# Altium schematic sheet DSV1-001（主板）原理图 V2.SchDoc: DSV1-001（主板）原理图
size A4; Date: a; ApprovedBy: 戚大周; CheckedBy: 戚大周; Author: 戚大周; CompanyName: i; DrawnBy: g; Engineer: h; Organization: 湖北滴水科技有限公司; Address1: 20230202; Address2: 20230202; Address3: 20230202; Address4: r; DocumentNumber: f; Revision: V2; SheetNumber: 1; SheetTotal: 1; PageSetup: Record=PageOptions|CenterHorizontal=True|CenterVertical=True|PrintScale=1.00|XCorrection=1.00|YCorrection=1.00|PrintKind=1|BorderSize=5000000|LeftOffset=0|BottomOffset=0|Orientation=2|PaperLength=1000|PaperWidth=1000|Scale=100|PaperSource=15|PrintQuality=1200|MediaType=1|DitherType=10|PaperKind=A4|PrintScaleMode=1; CurrentTime: p; CurrentDate: o; Time: v; DocumentFullPathAndName: s; DocumentName: d; ModifiedDate: k; ImagePath: j; ProjectName: l
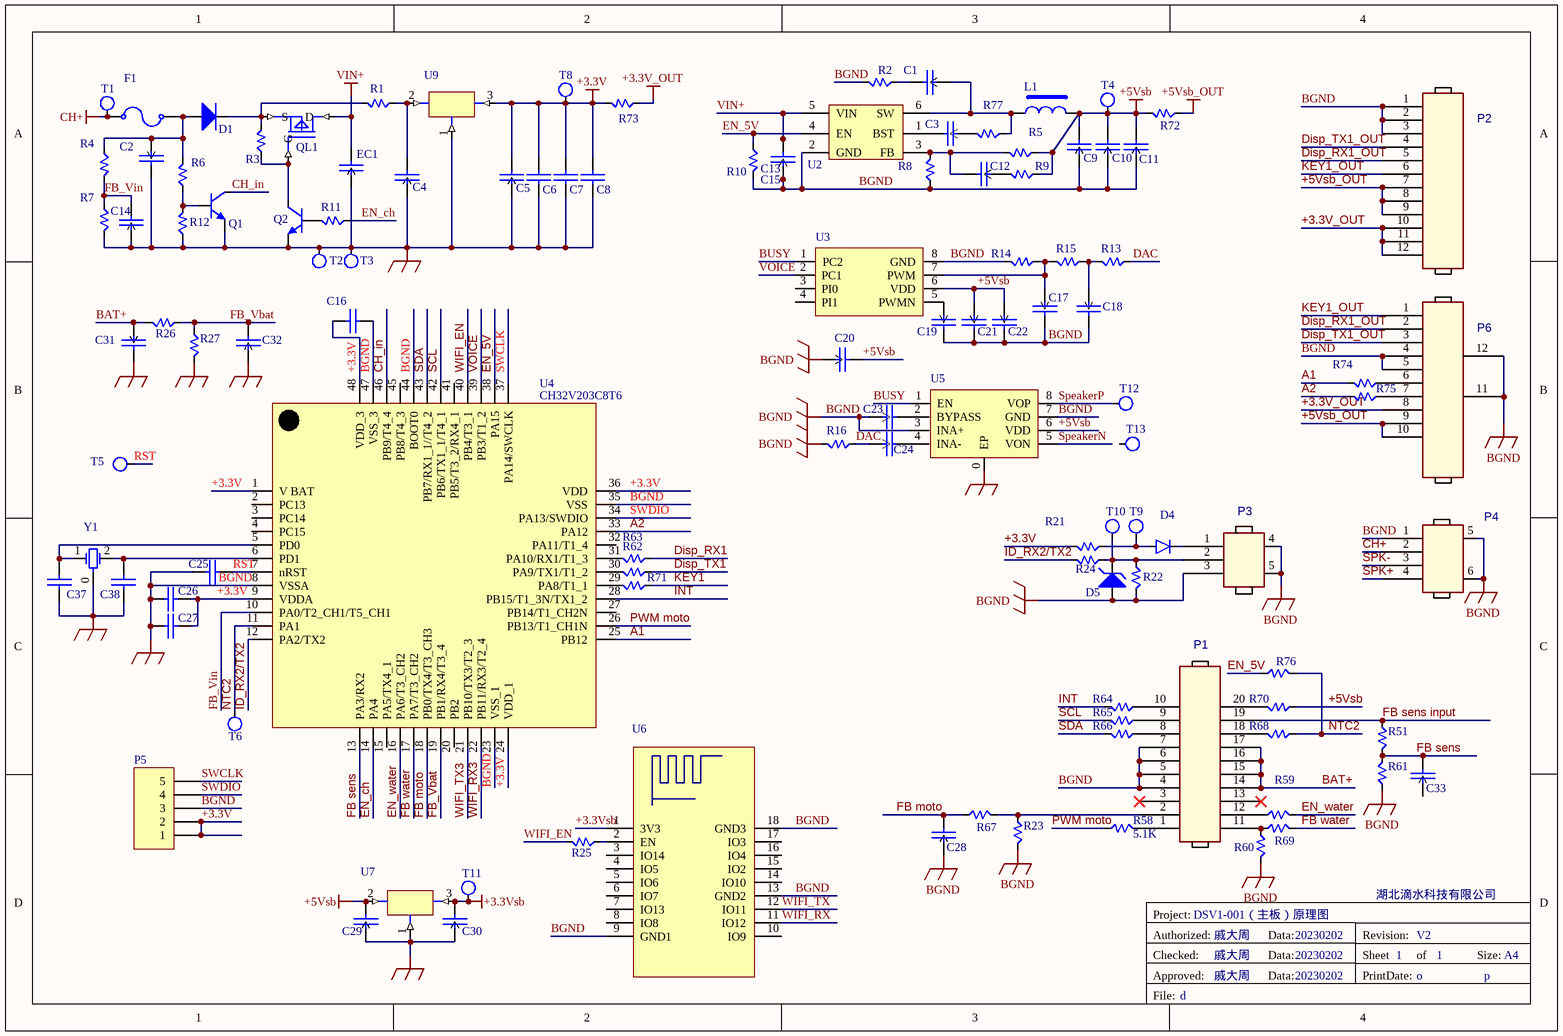
[diagram p0: DSV1-001（主板）原理图 V2.SchDoc]

## Parts
C1  102  [0603C]  (value not drawn)
C2  104  [0603C]  (value not drawn)
C3  104  [0603C]  (value not drawn)
C4  104  [0603C]  (value not drawn)
C5  226  [0603C]  (value not drawn)
C6  226  [0603c]  (value not drawn)
C7  103  [0603c]  (value not drawn)
C8  104  [0603c]  (value not drawn)
C9  226  [0603C]  (value not drawn)
C10  226  [0603C]  (value not drawn)
C11  104  [0603C]  (value not drawn)
C12  101  [0603C]  (value not drawn)
C13  104  [0603C]  (value not drawn)
C14  104  [0603C]  (value not drawn)
C15  104  [0603C]  (value not drawn)
C16  103  [0603c]  (value not drawn)
C17  102  [0603C]  (value not drawn)
C18  102  [0603C]  (value not drawn)
C19  102  [0603C]  (value not drawn)
C20  104  [0603C]  (value not drawn)
C21  105  [0805C]  (value not drawn)
C22  226  [0805C]  (value not drawn)
C23  105  [0603C]  (value not drawn)
C24  104  [0603C]  (value not drawn)
C25  103  [0603c]  (value not drawn)
C26  104  [0603c]  (value not drawn)
C27  105  [0603c]  (value not drawn)
C28  104  [0603C]  (value not drawn)
C29  NC  [0603c]  (value not drawn)
C30  NC  [0603c]  (value not drawn)
C31  104  [0603C]  (value not drawn)
C32  104  [0603C]  (value not drawn)
C33  104  [0603C]  (value not drawn)
C37  12P  [0603c]  (value not drawn)
C38  12P  [0603c]  (value not drawn)
D1  SS54L  [SMB-A]  (value not drawn)
D4  LMBR340  [SOD-123]  (value not drawn)
D5  TVS3.3V  [SOD-123]  (value not drawn)
EC1  476  [1210-c]  (value not drawn)
F1  1200mA/24V  [1206-R]  (value not drawn)
L1  4R7  [CLD-54]  (value not drawn)
P1  SGDBM-08-020P-H70  [SGDBM_08_020P_H40]  (value not drawn)
P2  SGDBM-08-012P-H70  [SGDBM_08_012P_H40]  (value not drawn)
P3  HEADER 3  [con125_03_wt_thw]  (value not drawn)
P4  BC-60-4P300-C06  [BC_60_4P_C06]  (value not drawn)
P5  (no value)  [2.0-5 顶针焊盘]
P6  HC 0.8 10PWT  [HC_08_10PWT]  (value not drawn)
Q1  MMBT2222A  [SOT-23-ss]  (value not drawn)
Q2  MMBT2222A  [SOT-23-ss]  (value not drawn)
QL1  MOS-P  [SOT-23-MOS-N]  (value not drawn)
R1  100R/0805  [0603R]  (value not drawn)
R2  22R  [0603R]  (value not drawn)
R3  510K  [0603r]  (value not drawn)
R4  10K  [0805R]  (value not drawn)
R5  68K  [0603R]  (value not drawn)
R6  100K  [0603R]  (value not drawn)
R7  1.6K  [0805r]  (value not drawn)
R8  9.1K  [0603R]  (value not drawn)
R9  2K  [0603R]  (value not drawn)
R10  100K  [0603R]  (value not drawn)
R11  5.1K  [0603R]  (value not drawn)
R12  10K  [0603R]  (value not drawn)
R13  10K  [0603R]  (value not drawn)
R14  470R  [0603R]  (value not drawn)
R15  4.7K  [0603R]  (value not drawn)
R16  2K  [0603R]  (value not drawn)
R21  16V/50mA  [0603r]  (value not drawn)
R22  1M  [0603R]  (value not drawn)
R23  10K  [0603R]  (value not drawn)
R24  1K  [0603r]  (value not drawn)
R25  NC  [0603r]  (value not drawn)
R26  10M  [0603r]  (value not drawn)
R27  1.6M  [0603r]  (value not drawn)
R51  5.1K  [0603R]  (value not drawn)
R58  5.1K  [0603R]
R59  5.1K  [0603R]  (value not drawn)
R60  10K  [0603R]  (value not drawn)
R61  10K  [0603R]  (value not drawn)
R62  100R  [0603R]  (value not drawn)
R63  100R  [0603R]  (value not drawn)
R64  100R  [0603R]  (value not drawn)
R65  100R  [0603R]  (value not drawn)
R66  100R  [0603R]  (value not drawn)
R67  1K  [0603R]  (value not drawn)
R68  100R  [0603R]  (value not drawn)
R69  1K  [0603R]  (value not drawn)
R70  33R  [0603R]  (value not drawn)
R71  1K  [0603R]  (value not drawn)
R72  0R  [0603R]  (value not drawn)
R73  33R  [0603R]  (value not drawn)
R74  100R  [0603R]  (value not drawn)
R75  100R  [0603R]  (value not drawn)
R76  10K  [0603R]  (value not drawn)
R77  0R  [0603R]  (value not drawn)
T1  (no value)  [TP]
T2  (no value)  [TP]
T3  (no value)  [TP]
T4  (no value)  [TP]
T5  (no value)  [TP]
T6  (no value)  [TP]
T8  (no value)  [TP]
T9  (no value)  [TP]
T10  (no value)  [TP]
T11  (no value)  [TP]
T12  (no value)  [TP]
T13  (no value)  [TP]
U2  JW5057S  [SOT23-6-T]  (value not drawn)
U3  FT61F141-RB  [SOP-8 xiao]  (value not drawn)
U4  CH32V203C8T6  [LQFP-48]
U5  FT61F141-RB  [SOP-8-0]  (value not drawn)
U6  HI3861  [ESP8266]  (value not drawn)
U7  LD1117AGC33  [SOT-89]  (value not drawn)
U9  ME6239A33M3G  [SOT-89]  (value not drawn)
Y1  8M  [3225 XTAL]  (value not drawn)

## Nets
+3.3V: C5.2 C6.1 C7.1 C8.1 C16.2 C26.1 C27.1 P5.1 P5.2 R21.2 R73.2 T8.1 U4.1(V_BAT) U4.9(VDDA) U4.24(VDD_1) U4.36(VDD) U4.48(VDD_3) U9.3
+3.3V_OUT: P2.10 P2.11 P2.12 P6.8 R73.1
+3.3Vsb: C30.2 T11.1 U6.1(3V3) U7.3
+5Vsb: C9.2 C10.2 C11.2 C20.2 C21.1 C22.1 C29.2 L1.2 R5.1 R9.1 R70.2 R72.2 T4.1 U3.6(VDD) U5.6(VDD) U7.2
+5Vsb_OUT: P2.7 P2.8 P2.9 P6.9 P6.10 R72.1
BGND: C2.2 C4.1 C5.1 C6.2 C7.2 C8.2 C9.1 C10.1 C11.1 C13.1 C14.1 C15.1 C16.1 C17.2 C18.2 C19.2 C20.1 C21.2 C22.2 C23.1 C25.2 C26.2 C27.2 C28.1 C29.1 C30.1 C31.2 C32.1 C37.2 C38.2 D5.1(A) EC1.1 P1.4 P1.5 P1.6 P1.7 P2.1 P2.2 P2.3 P3.3 P3.4 P3.5 P4.1 P4.5 P4.6 P5.3 P6.4 P6.5 P6.11 P6.12 Q1.2 Q2.2 R2.2 R7.1 R8.1 R10.2 R12.1 R14.1 R16.1 R22.1 R23.1 R27.1 R60.1 R61.2 T2.1 T3.1 U2.2(GND) U3.8(GND) U4.8(VSSA) U4.23(VSS_1) U4.35(VSS) U4.44(BOOT0) U4.47(VSS_3) U5.0(EP) U5.3(INA+) U5.7(GND) U6.9(GND1) U6.13(GND2) U6.18(GND3) U7.1 U9.1 Y1.0(GND)
CH+: F1.1 P4.2 T1.1
VIN+: C13.2 C15.2 EC1.2 QL1.D U2.5(VIN)
A1: R74.2 U4.25(PB12)
A2: R75.2 U4.33(PA12)
BAT+: C31.1 P1.14 P1.15 P1.16 P1.17 R26.1
BUSY: U3.1(PC2) U5.1(EN)
CH_in: Q1.3 U4.46(PB9/T4_4)
DAC: C24.1 R13.2 R16.2
Disp_RX1: R63.2
Disp_RX1_OUT: P2.5 P6.2
Disp_TX1: R62.2
Disp_TX1_OUT: P2.4 P6.3
EN_5V: R10.1 R76.2 U2.4(EN) U4.38(PA15)
EN_ch: R11.1 U4.14(PA4)
EN_water: R59.1 U4.16(PA6/T3_CH2)
FB moto: C28.2 R67.2 U4.18(PB0/TX4/T3_CH3)
FB sens: C33.2 R51.1 R61.1 U4.13(PA3/RX2)
FB sens input: P1.19 R51.2
FB water: R69.1 U4.17(PA7/T3_CH2)
FB_Vbat: C32.2 R26.2 R27.2 U4.19(PB1/RX4/T3_4)
FB_Vin: C14.2 R4.2 R7.2 U4.10(PA0/T2_CH1/T5_CH1)
ID_RX2/TX2: R24.2 U4.12(PA2/TX2)
INT: R64.1 U4.28(PB15/T1_3N/TX1_2)
KEY1: R71.2
KEY1_OUT: P2.6 P6.1
NTC2: R68.2 R76.1 T6.1 U4.11(PA1)
PWM moto: R58.2 U4.26(PB13/T1_CH1N)
RST: C25.1 T5.1 U4.7(nRST)
SCL: R65.1 U4.42(PB6/TX1_1/T4_1)
SDA: R66.1 U4.43(PB7/RX1_1//T4_2)
SpeakerN: U5.5(VON)
SpeakerP: T12.1 U5.8(VOP)
SPK+: P4.4
SPK-: P4.3
SWCLK: P5.5 U4.37(PA14/SWCLK)
SWDIO: P5.4 U4.34(PA13/SWDIO)
VOICE: U3.2(PC1) U4.39(PB3/T1_2)
WIFI_EN: R25.2 U4.40(PB4/T3_1)
WIFI_RX: U6.11(IO12)
WIFI_RX3: U4.22(PB11/RX3/T2_4)
WIFI_TX: U6.12(IO11)
WIFI_TX3: U4.21(PB10/TX3/T2_3)
NetC1_1: C1.1 L1.1 R77.1 U2.6(SW)
NetC1_2: C1.2 R2.1
NetC2_1: C2.1 D1.1(A) F1.2 R4.1 R6.2
NetC3_1: C3.1 R77.2
NetC3_2: C3.2 U2.1(BST)
NetC4_2: C4.2 R1.1 U9.2
NetC12_1: C12.1 R9.2
NetC12_2: C12.2 R5.2 R8.2 U2.3(FB)
NetC17_1: C17.1 R14.2 R15.1 U3.7(PWM)
NetC18_1: C18.1 R13.1 R15.2
NetC19_1: C19.1 U3.5(PWMN)
NetC23_2: C23.2 U5.2(BYPASS)
NetC24_2: C24.2 U5.4(INA-)
NetC37_1: C37.1 U4.5(PD0) Y1.1(OSC1)
NetC38_1: C38.1 U4.6(PD1) Y1.2(OSC2)
NetD1_2: D1.2(K) QL1.S R1.2 R3.2
NetD4_1: D4.1 R21.1 T9.1
NetD4_2: D4.2 P3.1
NetD5_2: D5.2(K) P3.2 R22.2 R24.1 T10.1
NetP1_1: P1.1 R58.1
NetP1_2: P1.2 R23.2 R67.1
NetP1_8: P1.8 R66.2
NetP1_9: P1.9 R65.2
NetP1_10: P1.10 R64.2
NetP1_11: P1.11 R60.2 R69.2
NetP1_12: P1.12 R59.2
NetP1_18: P1.18 R68.1
NetP1_20: P1.20 R70.1
NetP6_6: P6.6 R74.1
NetP6_7: P6.7 R75.1
NetQ1_1: Q1.1 R6.1 R12.2
NetQ2_1: Q2.1 R11.2
NetQ2_3: Q2.3 QL1.G R3.1
NetR25_1: R25.1 U6.2(EN)
NetR62_1: R62.1 U4.30(PA9/TX1/T1_2)
NetR63_1: R63.1 U4.31(PA10/RX1/T1_3)
NetR71_1: R71.1 U4.29(PA8/T1_1)

Not connected (* = marked no-connect by the designer): C33 1; P1 3* 13*; T13 1; U3 3(PI0) 4(PI1); U4 2(PC13) 3(PC14) 4(PC15) 15(PA5/TX4_1) 20(PB2) 27(PB14/T1_CH2N) 32(PA11/T1_4) 41(PB5/T3_2/RX4_1) 45(PB8/T4_3); U6 3(IO14) 4(IO5) 5(IO6) 6(IO7) 7(IO13) 8(IO8) 10(IO9) 14(IO10) 15(IO2) 16(IO4) 17(IO3)

## Notes on the sheet
- Project:
- Authorized:
- Checked:
- Approved:
- Data:
- Revision:
- Sheet
- PrintDate:
- of
- Size:
- A4
- File:

## Library data of the parts
C1 C17-C19 = CAP: Capacitor; 规格: 102/50V  0603  X7R  ±10%; 名称: 贴片电容
C2-C4 C11 C13-C15 C20 C24 C28 C31-C33 = CAP: Capacitor; 规格: 104/50V  0603  X7R  ±10%; 名称: 贴片电容
C5 C9 C10 C22 = CAP: Capacitor; 规格: 226/6.3V 0805  X7R  ±10%; 名称: 贴片电容
C6 = CAP: 规格: 226/6.3V 0805  X7R  ±10%; 名称: 贴片电容
C7 C16 C25 = CAP: 规格: 103/50V  0603  X7R  ±10%; 名称: 贴片电容
C8 C26 = CAP: 规格: 104/50V  0603  X7R  ±10%; 名称: 贴片电容
C12 = CAP: Capacitor; 规格: 101/50V  0603  X7R  ±10%; 名称: 贴片电容
C21 = CAP: Capacitor; 规格: 105/16V  0603  X7R  ±10%; 名称: 贴片电容
C23 = CAP: Capacitor; 规格: 105/50V  0603  X7R  ±10%; 名称: 贴片电容
C27 = CAP: 规格: 105/16V  0603  X7R  ±10%; 名称: 贴片电容
C29 C30 = CAP: Capacitor; 名称: 贴片电容; 规格: NC
C37 C38 = CAP: 规格: 12P/50V  0603  NPO  ±10%; 名称: 贴片电容
D1 = Diode 1N4448: High Conductance Fast Diode; 规格: SS54L/SMB/5A肖特基二极管; 名称: 贴片二极管
D4 = 1N4148: 规格: LMBR340FT1G   3A/40V     SOD-123FL; 名称: 贴片二极管
D5 = D Zener: Zener Diode; 规格: AQ4020-01FTG  3.3V SOD-323; 名称: 贴片二极管
EC1 = CAP: Capacitor; 规格: 476/25V  1210  X7R  ±10%; 名称: 贴片电容
F1 = FUSe-a: Fuse; 规格: 可恢复保险丝PPTC  1210  1200mA/24V; 名称: 贴片PTC
L1 = 电感: 名称: 贴片电感; 规格: 贴片功率电感 4.7uH CD32 3*3*2.1mm
P1 = HEADER 12_1: 规格: SGDBM-08-020P-H70（公+母=7mm） 公座  深圳山谷道; 名称: 贴片连接器
P2 = HEADER 12_0: 名称: 贴片连接器; 规格: NC
P3 = HEADER 3_1: 名称: 贴片连接器; 规格: 超薄1.25mm-3AWB卧式贴片 8.9*6.65*1.85mm
P4 = HEADER 4_1: 名称: 贴片连接器; 规格: BC-60-4P300-C06 间距3mm  塑体高3mm
P5 = Header 5: Header, 5-Pin; 规格: NC; 名称: 测试点
P6 = HEADER 12_2: 名称: 贴片连接器; 规格: HC 0.8 10PWT  立式贴片 华灿天禄
Q1 = 2N3904: NPN General Purpose Amplifier; 名称: 贴片三极管; 规格: MMBT2222A  SOT-23  长电
Q2 = 2N3904: NPN General Purpose Amplifier; 规格: MMBT2222A  SOT-23  长电; 名称: 贴片三极管
QL1 = MOS-P: 名称: 贴片IC; 规格: Si2319DS  P-MOSFET   -4.4A -40V   SOT-23   VISHAY
R1 = 电阻 - R: 规格: +片状电阻0805/100Ω1/8W±1%; 名称: 贴片电阻
R2 = 电阻 - R: 规格: +片状电阻0603/22Ω1/10W±1%; 名称: 贴片电阻
R3 = 电阻 - R: 规格: +片状电阻0603/510KΩ1/10W±1%; 名称: 贴片电阻
R4 = 电阻 - R: 规格: +片状电阻0805/10KΩ1/10W±1%; 名称: 贴片电阻
R5 R72-R75 = 电阻 - R: 规格: +片状电阻0603/68KΩ1/10W±1%; 名称: 贴片电阻
R6 R10 = 电阻 - R: 规格: +片状电阻0603/100KΩ1/10W±1%; 名称: 贴片电阻
R7 = 电阻 - R: 规格: +片状电阻0603/1.6KΩ1/10W±1%; 名称: 贴片电阻
R8 = 电阻 - R: 规格: +片状电阻0603/9.1KΩ1/10W±1%; 名称: 贴片电阻
R9 R16 R62 R63 R71 = 电阻 - R: 规格: +片状电阻0603/2KΩ1/10W±1%; 名称: 贴片电阻
R11 R51 R58 R59 = 电阻 - R: 规格: +片状电阻0603/5.1KΩ1/10W±1%; 名称: 贴片电阻
R12 R13 R23 R60 R61 R76 = 电阻 - R: 规格: +片状电阻0603/10KΩ1/10W±1%; 名称: 贴片电阻
R14 = 电阻 - R: 规格: +片状电阻0603/470Ω1/10W±1%; 名称: 贴片电阻
R15 = 电阻 - R: 规格: +片状电阻0603/4.7KΩ1/10W±1%; 名称: 贴片电阻
R21 = 电阻 - R: 规格: 可恢复保险丝PPTC  0805  50mA/16V  SMD0805P005TF; 名称: 贴片电阻
R22 = 电阻 - R: 规格: +片状电阻0603/1MΩ1/10W±1%; 名称: 贴片电阻
R24 R67 R69 = 电阻 - R: 规格: +片状电阻0603/1KΩ1/10W±1%; 名称: 贴片电阻
R25 = 电阻 - R: 名称: 贴片电阻; 规格: NC
R26 = 电阻 - R: 规格: +片状电阻0603/10MΩ1/10W±1%; 名称: 贴片电阻
R27 = 电阻 - R: 规格: +片状电阻0603/1.6MΩ1/10W±1%; 名称: 贴片电阻
R64-R66 R68 = 电阻 - R: 规格: +片状电阻0603/100Ω1/8W±5%; 名称: 贴片电阻
R70 = 电阻 - R: 规格: +片状电阻0603/33Ω1/8W±1%; 名称: 贴片电阻
R77 = 电阻 - R: 规格: +片状电阻0603/0Ω1/10W±1%; 名称: 贴片电阻
T1-T6 T8-T13 = TP: 规格: NC; 名称: 测试点
U2 = Header 6: Header, 6-Pin; 规格: JW5057S  TSOT23-6  杰华特; 名称: 贴片IC
U3 U5 = IC SOT-8: 62 Pin EISA Connector; 名称: 贴片IC; 规格: FT61F141-RB SOP-8
U4 = MM32F031: 规格: CH32V203C8T6 LQFP48  沁恒; 名称: 贴片IC
U6 = ESP8266: 名称: 贴片模块; 规格: NC
U7 = ME6203: 规格: NC; 名称: 贴片IC
U9 = ME6203: 规格: ME6239A33M3G  SOT-23-3 微盟; 名称: 贴片IC
Y1 = XTAL: 规格: 8Mhz 3225 ±20PPM  CL:12pF; 名称: 贴片晶振